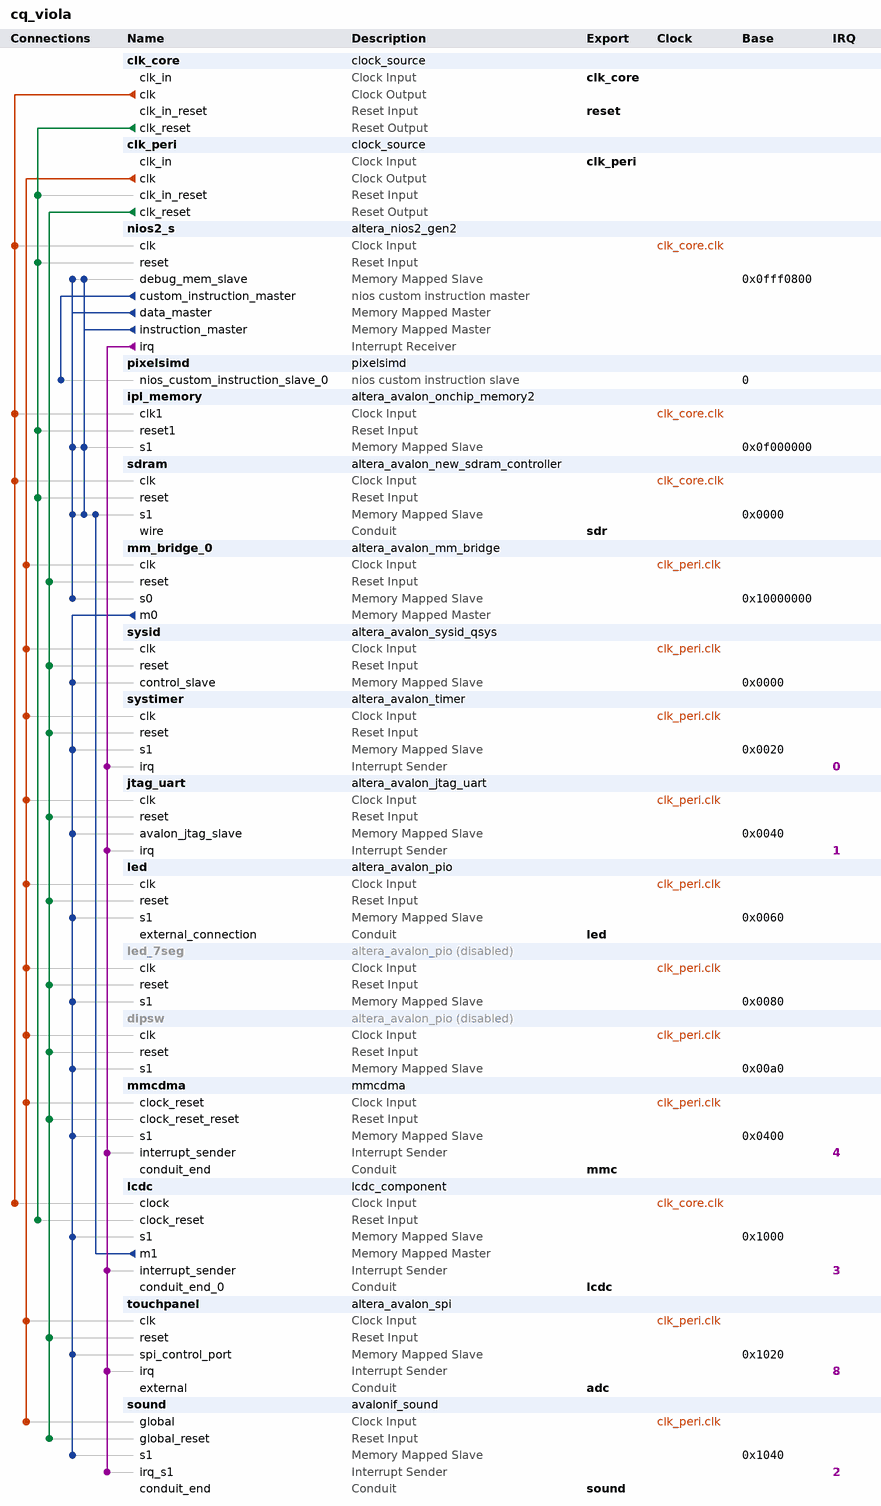
[diagram p0: system contents]
# Platform Designer (Qsys) system cq_viola, Cyclone IV E EP4CE6E22C8
# Parameters at their usual value, and those the tool derives, are not listed.
package require -exact qsys 15.0
create_system cq_viola
set_project_property DEVICE_FAMILY {Cyclone IV E}
set_project_property DEVICE EP4CE6E22C8

add_instance clk_core clock_source 15.0
set_instance_parameter_value clk_core clockFrequency 100000000

add_instance clk_peri clock_source 15.0
set_instance_parameter_value clk_peri clockFrequency 40000000

add_instance nios2_s altera_nios2_gen2 15.0
set_instance_parameter_value nios2_s dcache_size 0
set_instance_parameter_value nios2_s exceptionSlave sdram.s1
set_instance_parameter_value nios2_s icache_burstType Sequential
set_instance_parameter_value nios2_s icache_size 8192
set_instance_parameter_value nios2_s impl Fast
set_instance_parameter_value nios2_s resetSlave ipl_memory.s1
set_instance_parameter_value nios2_s setting_activateTrace true
set_instance_parameter_value nios2_s setting_branchpredictiontype Static

add_instance pixelsimd pixelsimd 1.0

add_instance ipl_memory altera_avalon_onchip_memory2 15.0
set_instance_parameter_value ipl_memory dataWidth 32
set_instance_parameter_value ipl_memory dualPort false
set_instance_parameter_value ipl_memory initMemContent true
set_instance_parameter_value ipl_memory initializationFileName cq_viola_boot
set_instance_parameter_value ipl_memory memorySize 8192
set_instance_parameter_value ipl_memory useNonDefaultInitFile true

add_instance sdram altera_avalon_new_sdram_controller 15.0
set_instance_parameter_value sdram TAC 6.0
set_instance_parameter_value sdram TRCD 20.0
set_instance_parameter_value sdram TRFC 67.5
set_instance_parameter_value sdram TRP 20.0
set_instance_parameter_value sdram TWR 15.0
set_instance_parameter_value sdram casLatency 2
set_instance_parameter_value sdram columnWidth 8
set_instance_parameter_value sdram dataWidth 16
set_instance_parameter_value sdram generateSimulationModel false
set_instance_parameter_value sdram initRefreshCommands 8
set_instance_parameter_value sdram model single_Micron_MT48LC4M32B2_7_chip
set_instance_parameter_value sdram numberOfBanks 4
set_instance_parameter_value sdram numberOfChipSelects 1
set_instance_parameter_value sdram powerUpDelay 200.0
set_instance_parameter_value sdram refreshPeriod 15.625
set_instance_parameter_value sdram rowWidth 12

add_instance mm_bridge_0 altera_avalon_mm_bridge 15.0
set_instance_parameter_value mm_bridge_0 ADDRESS_UNITS SYMBOLS
set_instance_parameter_value mm_bridge_0 ADDRESS_WIDTH 16
set_instance_parameter_value mm_bridge_0 DATA_WIDTH 32
set_instance_parameter_value mm_bridge_0 MAX_PENDING_RESPONSES 1
set_instance_parameter_value mm_bridge_0 USE_AUTO_ADDRESS_WIDTH 0

add_instance sysid altera_avalon_sysid_qsys 15.0
set_instance_parameter_value sysid id 538249235

add_instance systimer altera_avalon_timer 15.0
set_instance_parameter_value systimer period 1
set_instance_parameter_value systimer periodUnits MSEC

add_instance jtag_uart altera_avalon_jtag_uart 15.0
set_instance_parameter_value jtag_uart simInteractiveOptions NO_INTERACTIVE_WINDOWS

add_instance led altera_avalon_pio 15.0
set_instance_parameter_value led direction Output
set_instance_parameter_value led width 1

add_instance led_7seg altera_avalon_pio 15.0
set_instance_property led_7seg ENABLED false
set_instance_parameter_value led_7seg direction Output
set_instance_parameter_value led_7seg width 32

add_instance dipsw altera_avalon_pio 15.0
set_instance_property dipsw ENABLED false
set_instance_parameter_value dipsw direction Input
set_instance_parameter_value dipsw width 10

add_instance mmcdma mmcdma 1.0
set_instance_parameter_value mmcdma SYSTEMCLOCKINFO 40000000

add_instance lcdc lcdc_component 1.0

add_instance touchpanel altera_avalon_spi 15.0
set_instance_parameter_value touchpanel clockPolarity 0
set_instance_parameter_value touchpanel dataWidth 8
set_instance_parameter_value touchpanel masterSPI true
set_instance_parameter_value touchpanel numberOfSlaves 1
set_instance_parameter_value touchpanel targetClockRate 1000000

add_instance sound avalonif_sound 1.0

# connections
add_connection clk_core.clk ipl_memory.clk1 clock
add_connection clk_core.clk lcdc.clock clock
add_connection clk_core.clk nios2_s.clk clock
add_connection clk_core.clk sdram.clk clock
add_connection clk_peri.clk dipsw.clk clock
add_connection clk_peri.clk jtag_uart.clk clock
add_connection clk_peri.clk led.clk clock
add_connection clk_peri.clk led_7seg.clk clock
add_connection clk_peri.clk mm_bridge_0.clk clock
add_connection clk_peri.clk mmcdma.clock_reset clock
add_connection clk_peri.clk sound.global clock
add_connection clk_peri.clk sysid.clk clock
add_connection clk_peri.clk systimer.clk clock
add_connection clk_peri.clk touchpanel.clk clock
add_connection clk_core.clk_reset clk_peri.clk_in_reset reset
add_connection clk_core.clk_reset ipl_memory.reset1 reset
add_connection clk_core.clk_reset lcdc.clock_reset reset
add_connection clk_core.clk_reset nios2_s.reset reset
add_connection clk_core.clk_reset sdram.reset reset
add_connection clk_peri.clk_reset dipsw.reset reset
add_connection clk_peri.clk_reset jtag_uart.reset reset
add_connection clk_peri.clk_reset led.reset reset
add_connection clk_peri.clk_reset led_7seg.reset reset
add_connection clk_peri.clk_reset mm_bridge_0.reset reset
add_connection clk_peri.clk_reset mmcdma.clock_reset_reset reset
add_connection clk_peri.clk_reset sound.global_reset reset
add_connection clk_peri.clk_reset sysid.reset reset
add_connection clk_peri.clk_reset systimer.reset reset
add_connection clk_peri.clk_reset touchpanel.reset reset
add_connection lcdc.m1 sdram.s1 avalon
set_connection_parameter_value lcdc.m1/sdram.s1 baseAddress 0x0000
add_connection mm_bridge_0.m0 dipsw.s1 avalon
set_connection_parameter_value mm_bridge_0.m0/dipsw.s1 baseAddress 0x00a0
add_connection mm_bridge_0.m0 jtag_uart.avalon_jtag_slave avalon
set_connection_parameter_value mm_bridge_0.m0/jtag_uart.avalon_jtag_slave baseAddress 0x0040
add_connection mm_bridge_0.m0 lcdc.s1 avalon
set_connection_parameter_value mm_bridge_0.m0/lcdc.s1 baseAddress 0x1000
add_connection mm_bridge_0.m0 led.s1 avalon
set_connection_parameter_value mm_bridge_0.m0/led.s1 baseAddress 0x0060
add_connection mm_bridge_0.m0 led_7seg.s1 avalon
set_connection_parameter_value mm_bridge_0.m0/led_7seg.s1 baseAddress 0x0080
add_connection mm_bridge_0.m0 mmcdma.s1 avalon
set_connection_parameter_value mm_bridge_0.m0/mmcdma.s1 baseAddress 0x0400
add_connection mm_bridge_0.m0 sound.s1 avalon
set_connection_parameter_value mm_bridge_0.m0/sound.s1 baseAddress 0x1040
add_connection mm_bridge_0.m0 sysid.control_slave avalon
set_connection_parameter_value mm_bridge_0.m0/sysid.control_slave baseAddress 0x0000
add_connection mm_bridge_0.m0 systimer.s1 avalon
set_connection_parameter_value mm_bridge_0.m0/systimer.s1 baseAddress 0x0020
add_connection mm_bridge_0.m0 touchpanel.spi_control_port avalon
set_connection_parameter_value mm_bridge_0.m0/touchpanel.spi_control_port baseAddress 0x1020
add_connection nios2_s.data_master ipl_memory.s1 avalon
set_connection_parameter_value nios2_s.data_master/ipl_memory.s1 baseAddress 0x0f000000
add_connection nios2_s.data_master mm_bridge_0.s0 avalon
set_connection_parameter_value nios2_s.data_master/mm_bridge_0.s0 baseAddress 0x10000000
add_connection nios2_s.data_master nios2_s.debug_mem_slave avalon
set_connection_parameter_value nios2_s.data_master/nios2_s.debug_mem_slave baseAddress 0x0fff0800
add_connection nios2_s.data_master sdram.s1 avalon
set_connection_parameter_value nios2_s.data_master/sdram.s1 baseAddress 0x0000
add_connection nios2_s.instruction_master ipl_memory.s1 avalon
set_connection_parameter_value nios2_s.instruction_master/ipl_memory.s1 baseAddress 0x0f000000
add_connection nios2_s.instruction_master nios2_s.debug_mem_slave avalon
set_connection_parameter_value nios2_s.instruction_master/nios2_s.debug_mem_slave baseAddress 0x0fff0800
add_connection nios2_s.instruction_master sdram.s1 avalon
set_connection_parameter_value nios2_s.instruction_master/sdram.s1 baseAddress 0x0000
add_connection nios2_s.irq jtag_uart.irq interrupt
set_connection_parameter_value nios2_s.irq/jtag_uart.irq irqNumber 1
add_connection nios2_s.irq lcdc.interrupt_sender interrupt
set_connection_parameter_value nios2_s.irq/lcdc.interrupt_sender irqNumber 3
add_connection nios2_s.irq mmcdma.interrupt_sender interrupt
set_connection_parameter_value nios2_s.irq/mmcdma.interrupt_sender irqNumber 4
add_connection nios2_s.irq sound.irq_s1 interrupt
set_connection_parameter_value nios2_s.irq/sound.irq_s1 irqNumber 2
add_connection nios2_s.irq systimer.irq interrupt
set_connection_parameter_value nios2_s.irq/systimer.irq irqNumber 0
add_connection nios2_s.irq touchpanel.irq interrupt
set_connection_parameter_value nios2_s.irq/touchpanel.irq irqNumber 8
add_connection nios2_s.custom_instruction_master pixelsimd.nios_custom_instruction_slave_0 nios_custom_instruction
set_connection_parameter_value nios2_s.custom_instruction_master/pixelsimd.nios_custom_instruction_slave_0 CIName pixelsimd
set_connection_parameter_value nios2_s.custom_instruction_master/pixelsimd.nios_custom_instruction_slave_0 baseAddress 0

# exported interfaces
add_interface adc conduit end
set_interface_property adc EXPORT_OF touchpanel.external
add_interface clk_core clock sink
set_interface_property clk_core EXPORT_OF clk_core.clk_in
add_interface clk_peri clock sink
set_interface_property clk_peri EXPORT_OF clk_peri.clk_in
add_interface lcdc conduit end
set_interface_property lcdc EXPORT_OF lcdc.conduit_end_0
add_interface led conduit end
set_interface_property led EXPORT_OF led.external_connection
add_interface mmc conduit end
set_interface_property mmc EXPORT_OF mmcdma.conduit_end
add_interface reset reset sink
set_interface_property reset EXPORT_OF clk_core.clk_in_reset
add_interface sdr conduit end
set_interface_property sdr EXPORT_OF sdram.wire
add_interface sound conduit end
set_interface_property sound EXPORT_OF sound.conduit_end

set_interconnect_requirement {$system} qsys_mm.clockCrossingAdapter HANDSHAKE
set_interconnect_requirement {$system} qsys_mm.insertDefaultSlave false
set_interconnect_requirement {$system} qsys_mm.maxAdditionalLatency 1

save_system cq_viola.qsys
